# Altium schematic sheet QuickRotor_V1.SchDoc
size 490 x 283 mm
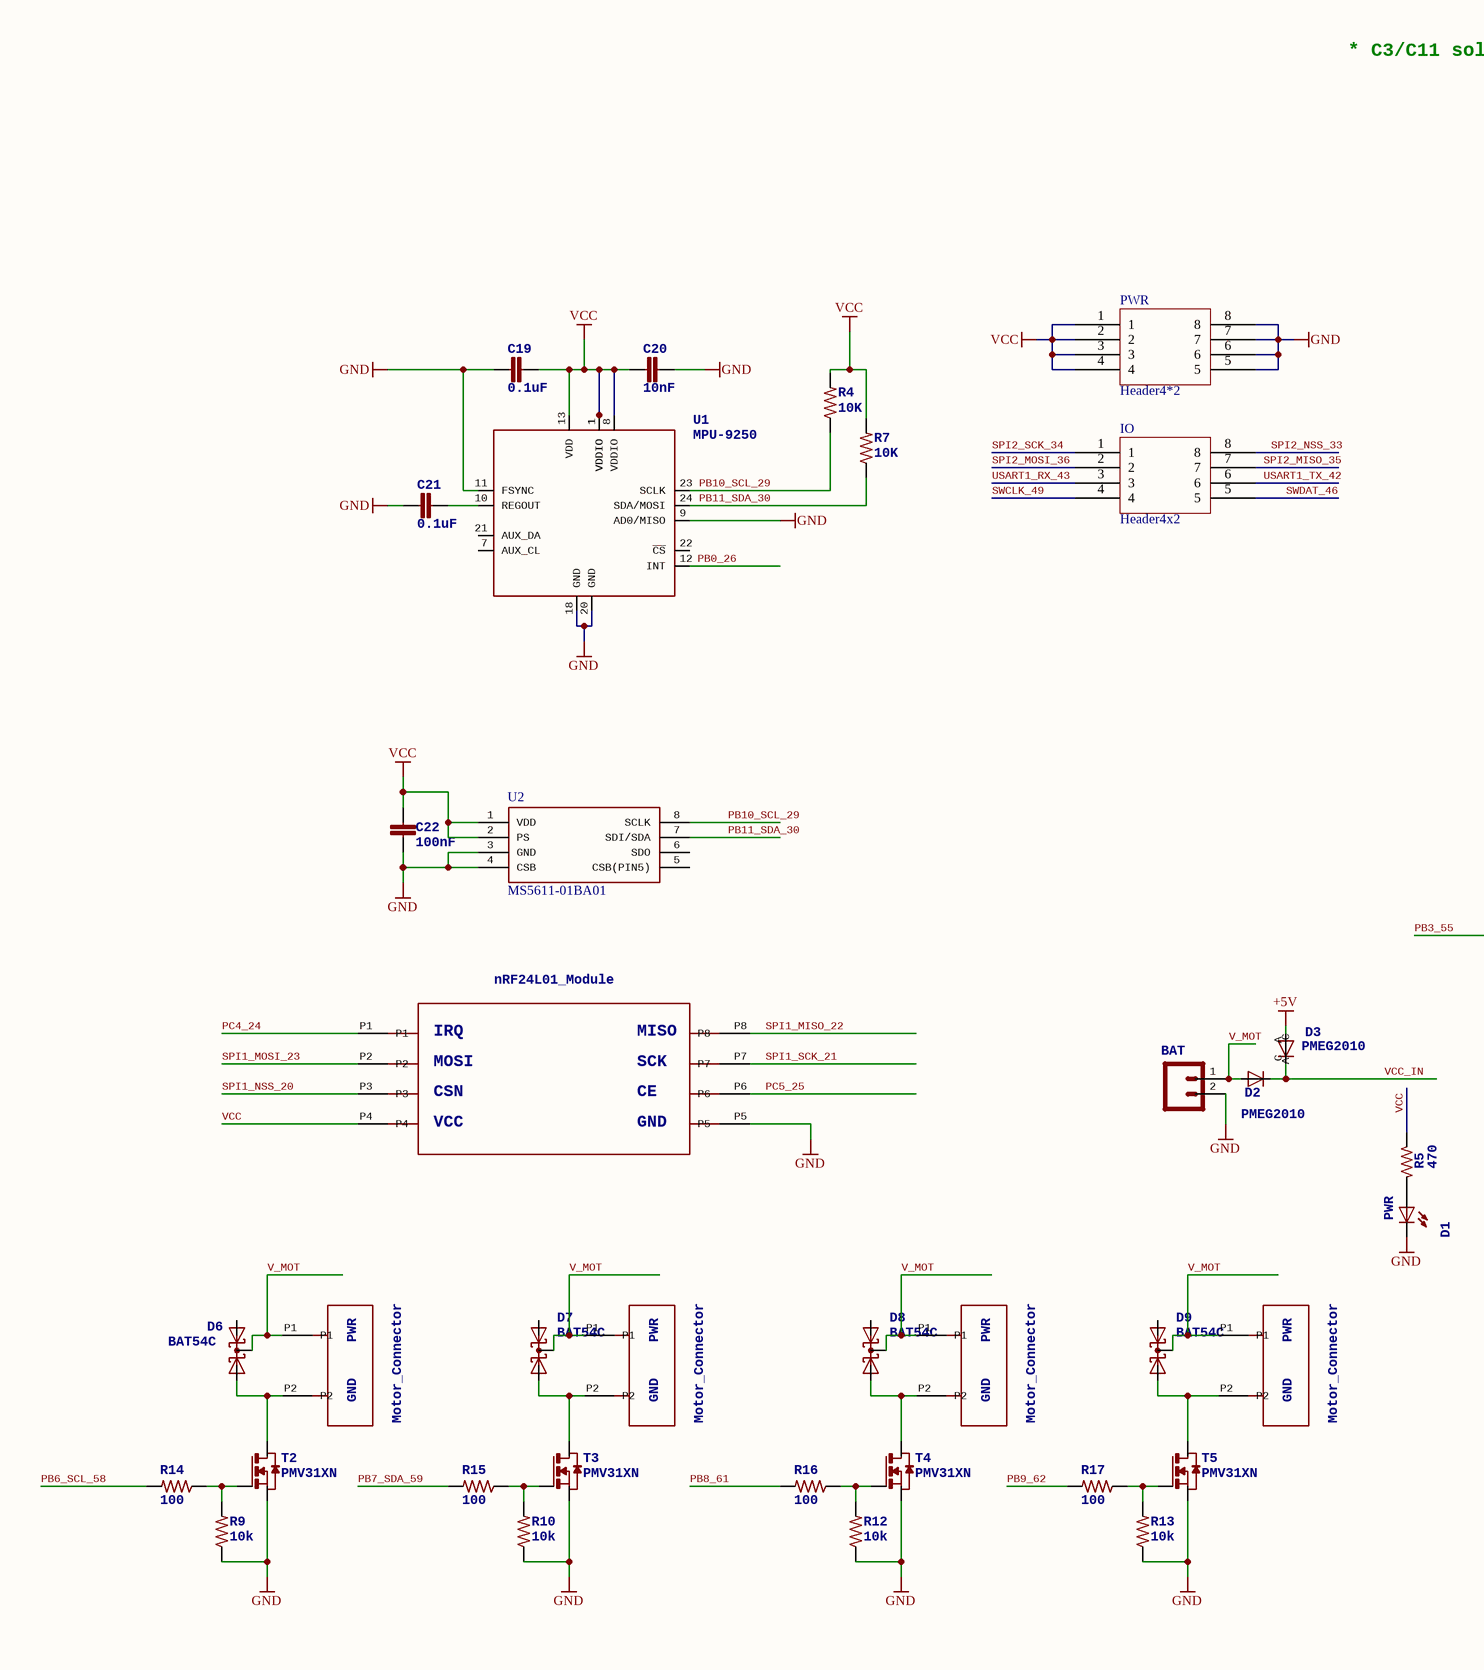
[diagram p0: QuickRotor_V1.SchDoc, left]
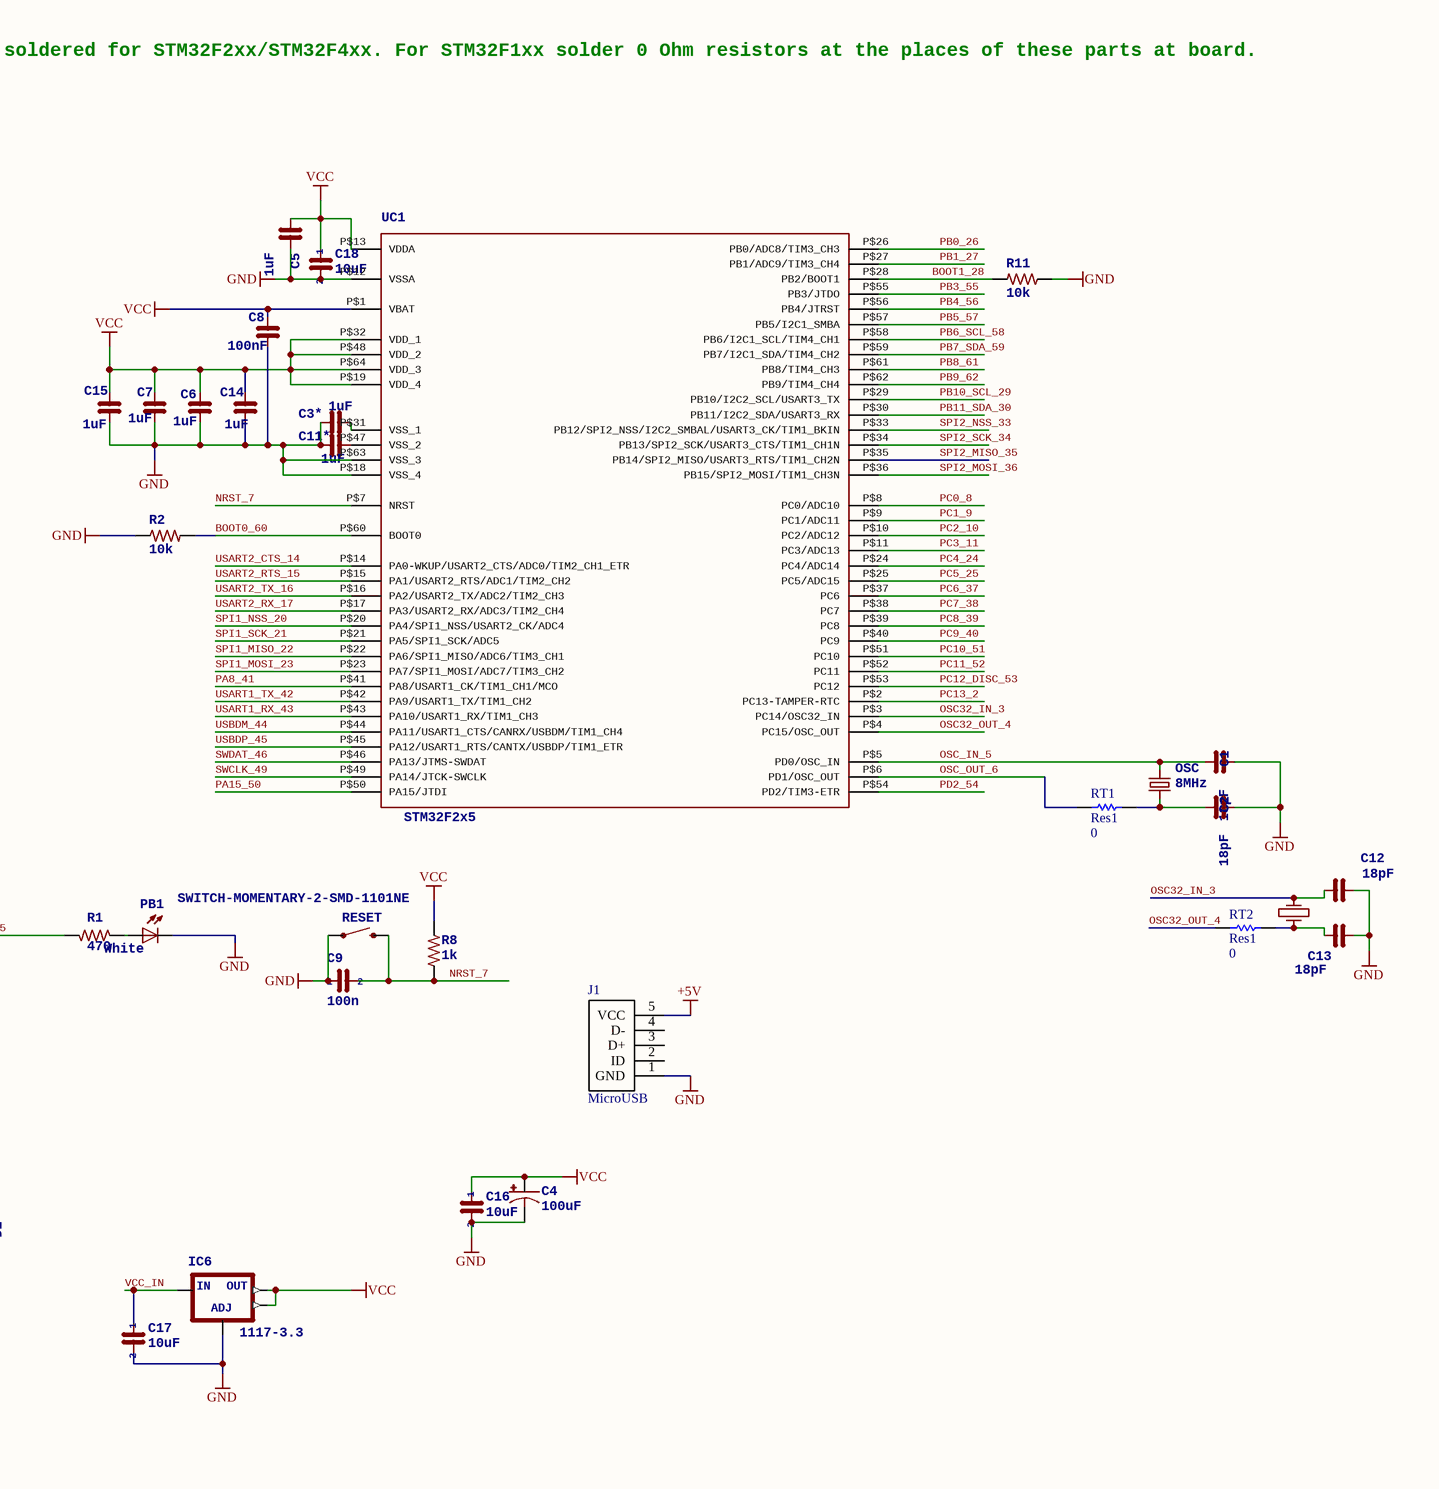
[diagram p1: QuickRotor_V1.SchDoc, right]

## Parts
24L01  NRF24L01_MODULE  [NRF24L01_MODULE]
BAT  M021X02_NO_SILK  [MOTOR_CONNECTOR]  (value not drawn)
C1  18pF  [0603-CAP]
C2  18pF  [0603-CAP]
C3*  1uF  [0603-CAP]
C4  100uF  [EIA3528]
C5  1uF  [0603-CAP]
C6  1uF  [0603-CAP]
C7  1uF  [0603-CAP]
C8  100nF  [0603-CAP]
C9  100n  [0603-CAP]
C11*  1uF  [0603-CAP]
C12  18pF  [0603-CAP]
C13  18pF  [0603-CAP]
C14  1uF  [0603-CAP]
C15  1uF  [0603-CAP]
C16  10uF  [0805-CAP]
C17  10uF  [0805-CAP]
C18  10uF  [0805-CAP]
C19  0.1uF  [0603-CAP]
C20  10nF  [0603-CAP]
C21  0.1uF  [0603-CAP]
C22  100nF  [0603-CAP]
D1  PWR  [0603-LED]
D2  PMEG2010  [SOD-323]
D3  PMEG2010  [SOD-323]
D6  BAT54C  [SOT23]
D7  BAT54C  [SOT23]
D8  BAT54C  [SOT23]
D9  BAT54C  [SOT23]
IC6  1117-3.3  [SOT223]
IO  Header4x2  [Header4x2]
J1  MicroUSB  [MicroUSB]
OSC  8MHz  [5032]
OSC2  32.768kHz  [SM8]  (value not drawn)
PB1  White  [0603-LED]
PWR  Header4*2  [Header4x2]
R1  470  [0603-RES]
R2  10k  [0603-RES]
R4  10K  [0603-RES]
R5  470  [0603-RES]
R7  10K  [0603-RES]
R8  1k  [0603-RES]
R9  10k  [0603-RES]
R10  10k  [0603-RES]
R11  10k  [0603-RES]
R12  10k  [0603-RES]
R13  10k  [0603-RES]
R14  100  [0603-RES]
R15  100  [0603-RES]
R16  100  [0603-RES]
R17  100  [0603-RES]
RESET  SWITCH-MOMENTARY-2-SMD-1101NE  [TACTILE-SWITCH-1101NE]
RT1  Res1  value 0  [0603-RES]
RT2  Res1  value 0  [0603-RES]
T2  PMV31XN  [SOT-23]
T3  PMV31XN  [SOT-23]
T4  PMV31XN  [SOT-23]
T5  PMV31XN  [SOT-23]
U1  MPU-9250  [QFN-24/3MM]
U2  MS5611-01BA01  [MS5611-01BA01]
U$3  MOTOR_CONNECTOR  [MOTOR_CONNECTOR]
U$4  MOTOR_CONNECTOR  [MOTOR_CONNECTOR]
U$5  MOTOR_CONNECTOR  [MOTOR_CONNECTOR]
U$6  MOTOR_CONNECTOR  [MOTOR_CONNECTOR]
UC1  STM32F2x5  [TQFP-10X10-64]

## Nets
+5V: D3.A J1.5(VCC)
GND: 24L01.P5 BAT.2 C1.1 C2.1 C3*.2 C4.C(-) C5.1 C6.1 C7.1 C8.1 C9.1 C11*.2 C12.1 C13.1 C14.1 C15.1 C16.2 C17.2 C18.2 C19.1 C20.2 C21.1 C22.2 D1.C IC6.1(ADJ) J1.1(GND) PB1.C PWR.5 PWR.6 PWR.7 PWR.8 R2.2 R9.1 R10.1 R11.1 R12.1 R13.1 RESET.P$1 T2.2(S) T3.2(S) T4.2(S) T5.2(S) U1.9(AD0/MISO) U1.11(FSYNC) U1.18(GND) U1.20(GND) U2.3(GND) U2.4(CSB) UC1.P$12(VSSA) UC1.P$18(VSS_4) UC1.P$63(VSS_3)
VCC: 24L01.P4 C4.A(+) C5.2 C6.2 C7.2 C8.2 C14.2 C15.2 C16.1 C18.1 C19.2 C20.1 C22.1 IC6.2(OUT) IC6.4(OUT) PWR.1 PWR.2 PWR.3 PWR.4 R4.2 R5.1 R7.2 R8.2 U1.1(VDDIO) U1.8(VDDIO) U1.13(VDD) U2.1(VDD) U2.2(PS) UC1.P$1(VBAT) UC1.P$13(VDDA) UC1.P$19(VDD_4) UC1.P$32(VDD_1) UC1.P$48(VDD_2) UC1.P$64(VDD_3)
BOOT0_60: R2.1 UC1.P$60(BOOT0)
BOOT1_28: R11.2 UC1.P$28(PB2/BOOT1)
NRST_7: C9.2 R8.1 RESET.P$2 UC1.P$7(NRST)
OSC32_IN_3: C12.2 OSC2.1(P$1) UC1.P$3(PC14/OSC32_IN)
OSC32_OUT_4: RT2.1 UC1.P$4(PC15/OSC_OUT)
OSC_IN_5: C1.2 OSC.3 UC1.P$5(PD0/OSC_IN)
OSC_OUT_6: RT1.1 UC1.P$6(PD1/OSC_OUT)
PA8_41: UC1.P$41(PA8/USART1_CK/TIM1_CH1/MCO)
PA15_50: UC1.P$50(PA15/JTDI)
PB0_26: U1.12(INT) UC1.P$26(PB0/ADC8/TIM3_CH3)
PB1_27: UC1.P$27(PB1/ADC9/TIM3_CH4)
PB3_55: R1.2 UC1.P$55(PB3/JTDO)
PB4_56: UC1.P$56(PB4/JTRST)
PB5_57: UC1.P$57(PB5/I2C1_SMBA)
PB6_SCL_58: R14.2 UC1.P$58(PB6/I2C1_SCL/TIM4_CH1)
PB7_SDA_59: R15.2 UC1.P$59(PB7/I2C1_SDA/TIM4_CH2)
PB8_61: R16.2 UC1.P$61(PB8/TIM4_CH3)
PB9_62: R17.2 UC1.P$62(PB9/TIM4_CH4)
PB10_SCL_29: R4.1 U1.23(SCLK) U2.8(SCLK) UC1.P$29(PB10/I2C2_SCL/USART3_TX)
PB11_SDA_30: R7.1 U1.24(SDA/MOSI) U2.7(SDI/SDA) UC1.P$30(PB11/I2C2_SDA/USART3_RX)
PC0_8: UC1.P$8(PC0/ADC10)
PC1_9: UC1.P$9(PC1/ADC11)
PC2_10: UC1.P$10(PC2/ADC12)
PC3_11: UC1.P$11(PC3/ADC13)
PC4_24: 24L01.P1 UC1.P$24(PC4/ADC14)
PC5_25: 24L01.P6 UC1.P$25(PC5/ADC15)
PC6_37: UC1.P$37(PC6)
PC7_38: UC1.P$38(PC7)
PC8_39: UC1.P$39(PC8)
PC9_40: UC1.P$40(PC9)
PC10_51: UC1.P$51(PC10)
PC11_52: UC1.P$52(PC11)
PC12_DISC_53: UC1.P$53(PC12)
PC13_2: UC1.P$2(PC13-TAMPER-RTC)
PD2_54: UC1.P$54(PD2/TIM3-ETR)
SPI1_MISO_22: 24L01.P8 UC1.P$22(PA6/SPI1_MISO/ADC6/TIM3_CH1)
SPI1_MOSI_23: 24L01.P2 UC1.P$23(PA7/SPI1_MOSI/ADC7/TIM3_CH2)
SPI1_NSS_20: 24L01.P3 UC1.P$20(PA4/SPI1_NSS/USART2_CK/ADC4)
SPI1_SCK_21: 24L01.P7 UC1.P$21(PA5/SPI1_SCK/ADC5)
SPI2_MISO_35: IO.7 UC1.P$35(PB14/SPI2_MISO/USART3_RTS/TIM1_CH2N)
SPI2_MOSI_36: IO.2 UC1.P$36(PB15/SPI2_MOSI/TIM1_CH3N)
SPI2_NSS_33: IO.8 UC1.P$33(PB12/SPI2_NSS/I2C2_SMBAL/USART3_CK/TIM1_BKIN)
SPI2_SCK_34: IO.1 UC1.P$34(PB13/SPI2_SCK/USART3_CTS/TIM1_CH1N)
SWCLK_49: IO.4 UC1.P$49(PA14/JTCK-SWCLK)
SWDAT_46: IO.5 UC1.P$46(PA13/JTMS-SWDAT)
USART1_RX_43: IO.3 UC1.P$43(PA10/USART1_RX/TIM1_CH3)
USART1_TX_42: IO.6 UC1.P$42(PA9/USART1_TX/TIM1_CH2)
USART2_CTS_14: UC1.P$14(PA0-WKUP/USART2_CTS/ADC0/TIM2_CH1_ETR)
USART2_RTS_15: UC1.P$15(PA1/USART2_RTS/ADC1/TIM2_CH2)
USART2_RX_17: UC1.P$17(PA3/USART2_RX/ADC3/TIM2_CH4)
USART2_TX_16: UC1.P$16(PA2/USART2_TX/ADC2/TIM2_CH3)
USBDM_44: UC1.P$44(PA11/USART1_CTS/CANRX/USBDM/TIM1_CH4)
USBDP_45: UC1.P$45(PA12/USART1_RTS/CANTX/USBDP/TIM1_ETR)
V_MOT: BAT.1 D2.A D6.3(CC) D7.3(CC) D8.3(CC) D9.3(CC) U$3.P1 U$4.P1 U$5.P1 U$6.P1
VCC_IN: C17.1 D2.C D3.C IC6.3(IN)
NetC2_2: C2.2 OSC.1 RT1.2
NetC3*_1: C3*.1 UC1.P$31(VSS_1)
NetC11*_1: C11*.1 UC1.P$47(VSS_2)
NetC13_2: C13.2 OSC2.4(P$2) RT2.2
NetC21_2: C21.2 U1.10(REGOUT)
NetD1_A: D1.A R5.2
NetD6_2: D6.2(A2) T2.1(D) U$3.P2
NetD7_2: D7.2(A2) T3.1(D) U$4.P2
NetD8_2: D8.2(A2) T4.1(D) U$5.P2
NetD9_2: D9.2(A2) T5.1(D) U$6.P2
NetPB1_A: PB1.A R1.1
NetR9_2: R9.2 R14.1 T2.3(G)
NetR10_2: R10.2 R15.1 T3.3(G)
NetR12_2: R12.2 R16.1 T4.3(G)
NetR13_2: R13.2 R17.1 T5.3(G)

Not connected (* = marked no-connect by the designer): D6 1(A1); D7 1(A1); D8 1(A1); D9 1(A1); J1 2(ID) 3(D+) 4(D-); U1 7(AUX_CL) 21(AUX_DA) 22(~{CS}); U2 5(CSB(PIN5)) 6(SDO)

## Notes on the sheet
- * C3/C11 soldered for STM32F2xx/STM32F4xx. For STM32F1xx solder 0 Ohm resistors at the places of these parts at board.

## Library data of the parts
BAT = M021X02_NO_SILK: Header 2Standard 2-pin 0.1" header. Use with straight break away headers (SKU : PRT-00116), right angle break away headers (PRT-00553), swiss pins (PRT-00743), machine pins (PRT-00117), and female headers (PRT-00115). Molex polarized connector foot print use with SKU : PRT-08233 with associated crimp pins and housings.; pin to pad: 1>P1 2>P2
C1 C2 C3* C5-C9 C11* C12-C15 = C_0603: NON-POLARIZED CAP
  C9: 1: 1; 2: 2
C4 = CAP_POL3528: Capacitor PolarizedThese are standard SMD and PTH capacitors. Normally 10uF, 47uF, and 100uF in electrolytic and tantalum varieties. Always verify the external diameter of the through hole cap, it varies with capacity, voltage, and manufacturer. The EIA devices should be standard.
C16-C18 = C_0805: NON-POLARIZED CAP; 1: 1; 2: 2
C19-C21 = CC0603: CAPACITOR, European symbol; SPICEMODEL: NONE; SPICEPREFIX: C; SpiceOrder1: SpiceOrder 1; SpiceOrder2: SpiceOrder 2
C22 = CAP0603-CAP: CapacitorStandard 0603 ceramic capacitor, and 0.1" leaded capacitor.
D1 PB1 = LEDCHIP-LED0603: LED   OSRAM: - CHIPLED LG R971, LG N971, LY N971, LG Q971, LY Q971, LO R971, LY R971 LH N974, LH R974 LS Q976, LO Q976, LY Q976 LO Q996 - Hyper CHIPLED LW Q18S LB Q993, LB Q99A, LB R99A - SideLED LS A670, LO A670, LY A670, LG A670, LP A670 LB A673, LV A673, LT A673, LW A673 LH A674 LY A675 LS A676, LA A676, LO A676, LY A676, LW A676 LS A679, LY A679, LG A679 -  Hyper Micro SIDELED® LS Y876, LA Y876, LO Y876, LY Y876 LT Y87S - SmartLED LW L88C, LW L88S LB L89C, LB L89S, LG L890 LS L89K, LO L89K, LY L89K LS L896, LA L896, LO L896, LY L896 - TOPLED LS T670, LO T670, LY T670, LG T670, LP T670 LSG T670, LSP T670, LSY T670, LOP T670, LYG T670 LG T671, LOG T671, LSG T671 LB T673, LV T673, LT T673, LW T673 LH T674 LS T676, LA T676, LO T676, LY T676, LB T676, LH T676, LSB T676, LW T676 LB T67C, LV T67C, LT T67C, LS T67K, LO T67K, LY T67K, LW E67C LS E67B, LA E67B, LO E67B, LY E67B, LB E67C, LV E67C, LT E67C LW T67C LS T679, LY T679, LG T679 LS T770, LO T770, LY T770, LG T770, LP T770 LB T773, LV T773, LT T773, LW T773 LH T774 LS E675, LA E675, LY E675, LS T675 LS T776, LA T776, LO T776, LY T776, LB T776 LHGB T686 LT T68C, LB T68C - Hyper Mini TOPLED® LB M676 - Mini TOPLED Santana® LG M470 LS M47K, LO M47K, LY M47K    Source: http://www.osram.convergy.de   LUXEON: - LUMILED® LXK2-PW12-R00, LXK2-PW12-S00, LXK2-PW14-U00, LXK2-PW14-V00 LXK2-PM12-R00, LXK2-PM12-S00, LXK2-PM14-U00 LXK2-PE12-Q00, LXK2-PE12-R00, LXK2-PE12-S00, LXK2-PE14-T00, LXK2-PE14-U00 LXK2-PB12-K00, LXK2-PB12-L00, LXK2-PB12-M00, LXK2-PB14-N00, LXK2-PB14-P00, LXK2-PB14-Q00 LXK2-PR12-L00, LXK2-PR12-M00, LXK2-PR14-Q00, LXK2-PR14-R00 LXK2-PD12-Q00, LXK2-PD12-R00, LXK2-PD12-S00 LXK2-PH12-R00, LXK2-PH12-S00 LXK2-PL12-P00, LXK2-PL12-Q00, LXK2-PL12-R00    Source: www.luxeon.com   KINGBRIGHT:   KA-3528ASYC Source: www.kingbright.com
D2 D3 = DIODESOD-323: Diode   SMADIODE - SMA Surface Mount Package  20V 1A Schottky Diode Digikey: 641-1014-6-ND    DO-1N4148 - Through Hole Small Current Diode SOD-123 20V 1 A (.5mV Vf) Schottky Diode - Digikey: MBRX120TPMSCT-ND    SOD-323 10V 570mA (.38mV Vf, 3ns) Schottky Diode - Digikey: ZLLS410CT-ND    SOD-523 30V 30mA Schottky Diode (RB751S-40TE61) - Digikey: RB751S-40TE61CT-ND    SOT23-R/W - SOT23 Package (R = Solder Paste/Reflow Ovens, W = Hand-Soldering)  BAT54Film 40V 300mA - Digikey: 497-7162-1-ND
D6-D9 = BAT54C: Schottky Diodes   Source: Fairchild .. BAT54.pdf
IC6 = V_REG_LM1117SOT223: Voltage Regulator LM1117Standard adjustable voltage regulator but in SMD form. Spark Fun Electronics SKU : COM-00595; ADJ: ADJ; IN: IN; OUT: OUT
IO PWR = Component_1
J1 = MicroUSB: Imported
OSC = CRYSTAL5X3: CrystalsVarious standard crystals. Proven footprints. Spark Fun Electronics SKU : COM-00534; pin to pad: 3>2
OSC2 = CRYSTALL
R1 R2 R5 R8 R11 = R_0603: RESISTOR
R4 R7 R9 R10 R12-R17 = RESISTOR0603: ResistorBasic schematic elements and footprints for 0603, 1206, and PTH resistors.
RT1 RT2 = Res1: Resistor; Published: 8-Jun-2000; LatestRevisionDate: 17-Jul-2002; LatestRevisionNote: Re-released for DXP Platform.; PackageReference: AXIAL-0.3; Publisher: Altium Limited; PackageDescription: Axial Device, Thru-Hole; 2 Leads; 0.3 in Pin Spacing
T2-T5 = NMOSSOT23: MOS FET; OC_FARNELL: unknown; OC_NEWARK: unknown
U1 = MPU-9250: GYRO/ACCEL/COMPASS/9-AXIS; DIGIKEY: 1428-1019-1-ND
UC1 = STM32F103
24L01 = NRF24L01_MODULE: nRF24L01_Module: nRF24L01_Module; IRQ: IRQ; MOSI: MOSI; CSN: CSN; VCC: VCC; GND: GND; CE: CE; SCK: SCK; MISO: MISO
U$3-U$6 = MOTOR_CONNECTOR: Motor_Connector: Motor_Connector; PWR: PWR; GND: GND